# Altium schematic sheet Multi.SchDoc
size 254 x 330 mm
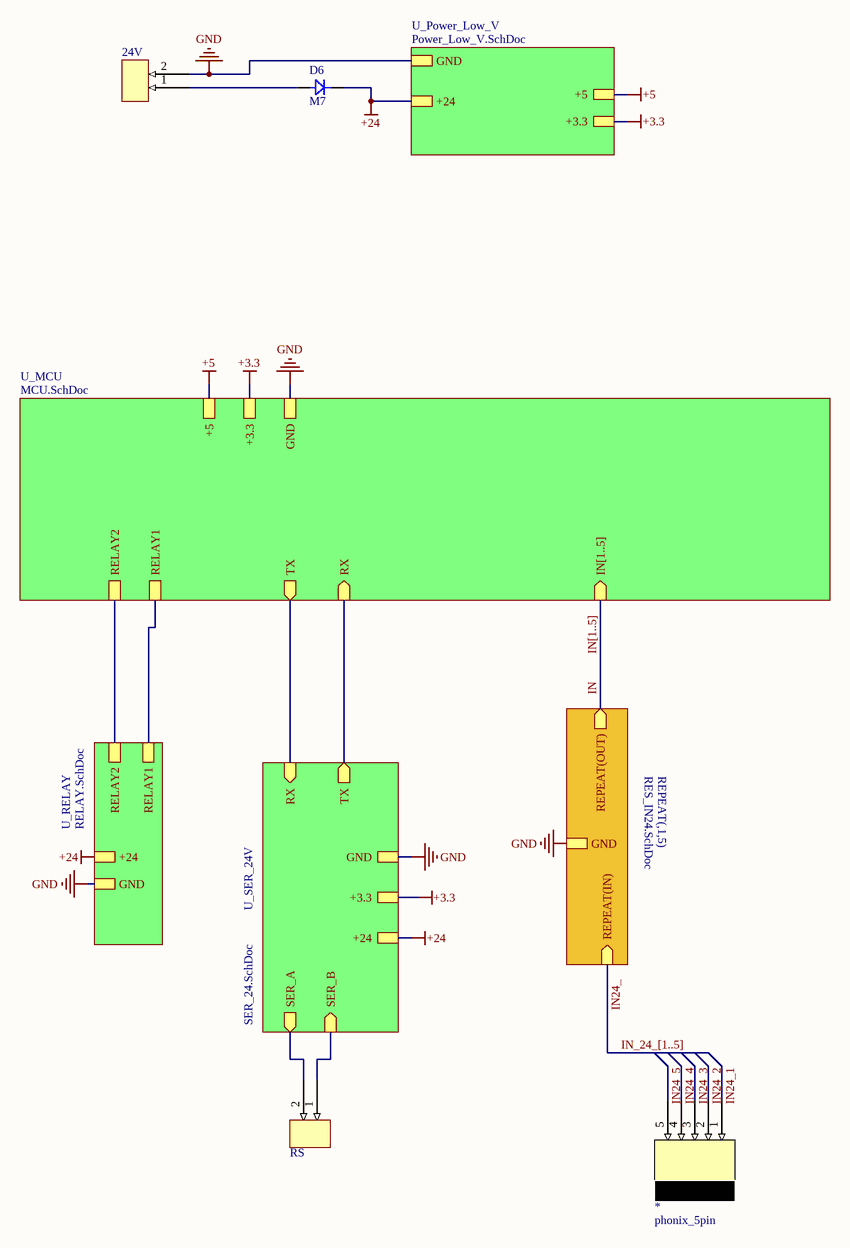
[diagram p0: Multi.SchDoc]

## Parts
24V  (no value)  [CONECTOR/FONIX/2PIN]
*  phonix_5pin  [phonix_5pin]
D6  M7  [DIOD/1N4007/SMD]
RS  (no value)  [CONECTOR/FONIX/2PIN]

## Sub-sheets
REPEAT(,1,5) = RES_IN24.SchDoc: GND, REPEAT(IN) (in), REPEAT(OUT) (out)
U_MCU = MCU.SchDoc: GND, +5, +3.3, IN[1..5] (in), RX (in), TX (out), RELAY1, RELAY2
U_Power_Low_V = Power_Low_V.SchDoc: GND, +24, +3.3, +5
U_RELAY = RELAY.SchDoc: RELAY1, RELAY2, GND, +24
U_SER_24V = SER_24.SchDoc: SER_A (out), GND, +24, +3.3, TX (out), RX (in), SER_B (in)

## Nets
+3.3: sheet U_SER_24V/+3.3, sheet U_MCU/+3.3, sheet U_Power_Low_V/+3.3
+5: sheet U_MCU/+5, sheet U_Power_Low_V/+5
+24: D6.K ; sheet U_SER_24V/+24, sheet U_Power_Low_V/+24, sheet U_RELAY/+24
GND: 24V.2 ; sheet REPEAT(,1,5)/GND, sheet U_SER_24V/GND, sheet U_MCU/GND, sheet U_Power_Low_V/GND, sheet U_RELAY/GND
IN: sheet REPEAT(,1,5)/REPEAT(OUT)
IN24_: sheet REPEAT(,1,5)/REPEAT(IN)
IN24_1: *.1
IN24_2: *.2
IN24_3: *.3
IN24_4: *.4
IN24_5: *.5
Net24V_1: 24V.1 D6.A
NetRS_1: RS.1 ; sheet U_SER_24V/SER_B
NetRS_2: RS.2 ; sheet U_SER_24V/SER_A
(unnamed): sheet U_SER_24V/TX, sheet U_MCU/RX
(unnamed): sheet U_SER_24V/RX, sheet U_MCU/TX
(unnamed): sheet U_MCU/RELAY1, sheet U_RELAY/RELAY1
(unnamed): sheet U_MCU/RELAY2, sheet U_RELAY/RELAY2

## Buses and harness runs
bus IN[1..5] = sheet U_MCU/IN[1..5]
bus IN_24_[1..5]

## Library data of the parts
24V RS = CONECTOR/FONIX/2PIN
D6 = DIOD/RECTIFIERS